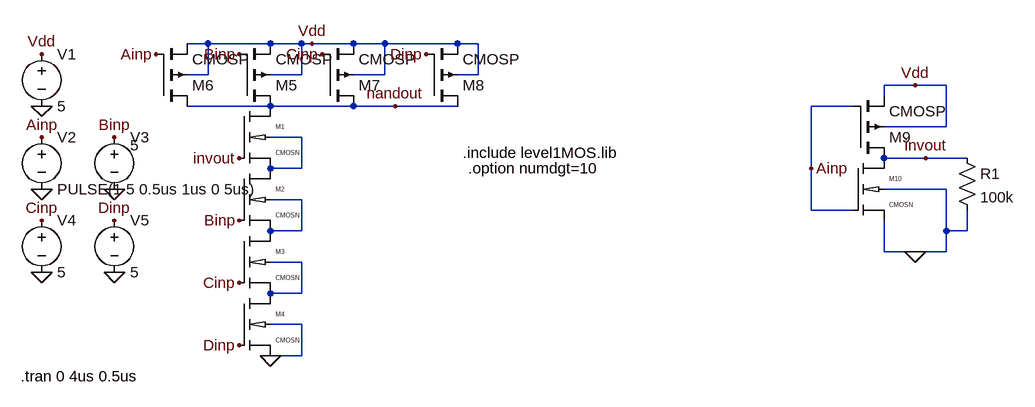
[diagram p0: schematic inv_4inpNAND.asc]
inv_4inpNAND.asc, the LTspice schematic file:
Version 4
SHEET 1 1312 680
WIRE 96 16 64 16
WIRE 192 16 96 16
WIRE 240 16 192 16
WIRE 256 16 240 16
WIRE 320 16 256 16
WIRE 368 16 320 16
WIRE 480 16 368 16
WIRE 512 16 480 16
WIRE 96 64 96 16
WIRE 96 64 64 64
WIRE 240 64 240 16
WIRE 240 64 192 64
WIRE 368 64 368 16
WIRE 368 64 320 64
WIRE 512 64 512 16
WIRE 512 64 480 64
WIRE 1184 80 1136 80
WIRE 1232 80 1184 80
WIRE 1136 96 1136 80
WIRE 192 112 64 112
WIRE 320 112 192 112
WIRE 384 112 320 112
WIRE 480 112 384 112
WIRE 1088 112 1024 112
WIRE 1232 144 1232 80
WIRE 1232 144 1136 144
WIRE 240 160 192 160
WIRE 1200 192 1136 192
WIRE 1264 192 1200 192
WIRE 240 208 240 160
WIRE 240 208 192 208
WIRE 1024 208 1024 112
WIRE 1232 240 1136 240
WIRE 240 256 192 256
WIRE 1024 272 1024 208
WIRE 1088 272 1024 272
WIRE 240 304 240 256
WIRE 240 304 192 304
WIRE 1232 304 1232 240
WIRE 1264 304 1264 272
WIRE 1264 304 1232 304
WIRE 1136 336 1136 288
WIRE 1184 336 1136 336
WIRE 1232 336 1232 304
WIRE 1232 336 1184 336
WIRE 240 352 192 352
WIRE 240 400 240 352
WIRE 240 400 192 400
WIRE 240 448 192 448
WIRE 240 496 240 448
WIRE 240 496 192 496
FLAG 16 32 Ainp
FLAG 144 288 Binp
FLAG 144 32 Binp
FLAG 144 384 Cinp
FLAG 272 32 Cinp
FLAG 144 480 Dinp
FLAG 432 32 Dinp
FLAG 192 496 0
FLAG -160 240 0
FLAG -160 112 0
FLAG -160 160 Ainp
FLAG -160 32 Vdd
FLAG 256 16 Vdd
FLAG -48 240 0
FLAG -160 368 0
FLAG -48 368 0
FLAG -48 160 Binp
FLAG -160 288 Cinp
FLAG -48 288 Dinp
FLAG 1184 336 0
FLAG 1184 80 Vdd
FLAG 384 112 nandout
FLAG 1200 192 invout
FLAG 144 192 invout
FLAG 1024 208 Ainp
SYMBOL cmosn 144 112 R0
SYMATTR InstName M1
SYMATTR Value2 l=0.36u w=0.72u
SYMBOL cmosn 144 208 R0
SYMATTR InstName M2
SYMATTR Value2 l=0.36u w=0.72u
SYMBOL cmosn 144 304 R0
SYMATTR InstName M3
SYMATTR Value2 l=0.36u w=0.72u
SYMBOL cmosn 144 400 R0
SYMATTR InstName M4
SYMATTR Value2 l=0.36u w=0.72u
SYMBOL cmosp 144 112 M180
SYMATTR InstName M5
SYMATTR Value2 l=0.36u w=2.88u
SYMBOL cmosp 16 112 M180
SYMATTR InstName M6
SYMATTR Value2 l=0.36u w=2.88u
SYMBOL cmosp 272 112 M180
SYMATTR InstName M7
SYMATTR Value2 l=0.36u w=2.88u
SYMBOL cmosp 432 112 M180
SYMATTR InstName M8
SYMATTR Value2 l=0.36u w=2.88u
SYMBOL voltage -160 16 R0
WINDOW 123 0 0 Left 2
WINDOW 39 0 0 Left 2
SYMATTR InstName V1
SYMATTR Value 5
SYMBOL voltage -160 144 R0
WINDOW 123 0 0 Left 2
WINDOW 39 0 0 Left 2
SYMATTR InstName V2
SYMATTR Value PULSE(1 5 0.5us 1us 0 5us)
SYMBOL voltage -48 144 R0
WINDOW 123 0 0 Left 2
WINDOW 39 0 0 Left 2
WINDOW 3 24 28 Left 2
SYMATTR InstName V3
SYMATTR Value 5
SYMBOL voltage -160 272 R0
WINDOW 123 0 0 Left 2
WINDOW 39 0 0 Left 2
SYMATTR InstName V4
SYMATTR Value 5
SYMBOL voltage -48 272 R0
WINDOW 123 0 0 Left 2
WINDOW 39 0 0 Left 2
SYMATTR InstName V5
SYMATTR Value 5
SYMBOL cmosp 1088 192 M180
SYMATTR InstName M9
SYMATTR Value2 l=0.36u w=1.44u
SYMBOL cmosn 1088 192 R0
SYMATTR InstName M10
SYMATTR Value2 l=0.36u w=0.72u
SYMBOL res 1248 176 R0
SYMATTR InstName R1
SYMATTR Value 100k
TEXT -192 528 Left 2 !.tran 0 4us 0.5us
TEXT 488 184 Left 2 !.include level1MOS.lib
TEXT 496 208 Left 2 !.option numdgt=10

The netlist it stands for:
* inv_4inpNAND.asc
M1 nandout invout N001 N001 CMOSN l=0.36u w=0.72u
M2 N001 Binp N002 N002 CMOSN l=0.36u w=0.72u
M3 N002 Cinp N003 N003 CMOSN l=0.36u w=0.72u
M4 N003 Dinp 0 0 CMOSN l=0.36u w=0.72u
M5 nandout Binp Vdd Vdd CMOSP l=0.36u w=2.88u
M6 nandout Ainp Vdd Vdd CMOSP l=0.36u w=2.88u
M7 nandout Cinp Vdd Vdd CMOSP l=0.36u w=2.88u
M8 nandout Dinp Vdd Vdd CMOSP l=0.36u w=2.88u
V1 Vdd 0 5
V2 Ainp 0 PULSE(1 5 0.5us 1us 0 5us)
V3 Binp 0 5
V4 Cinp 0 5
V5 Dinp 0 5
M9 invout Ainp Vdd Vdd CMOSP l=0.36u w=1.44u
M10 invout Ainp 0 0 CMOSN l=0.36u w=0.72u
R1 invout 0 100k
.model NMOS NMOS
.model PMOS PMOS
.lib standard.mos
.tran 0 4us 0.5us
.include level1MOS.lib
.option numdgt=10
.lib tsmc018.lib
.backanno
.end

* Results of the author's LTspice run, read from the files saved beside the schematic
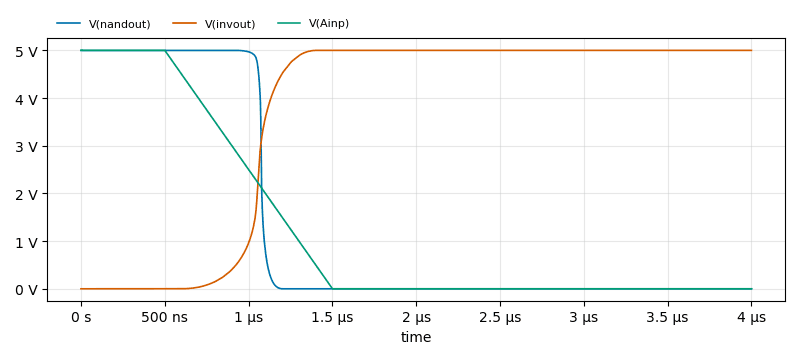
[diagram p1: Transient Analysis of inv_4inpNAND.asc, plotted from the saved traces]
* Transient Analysis, 1 run:
*   V(nandout): min -28.15 µV, max 5 V, average 1.351 V, rms 2.585 V, last 0 V
*   V(invout): min -5.542 µV, max 5 V, average 3.674 V, rms 4.242 V, last 5 V
*   V(Ainp): min 0 V, max 5 V, average 1.25 V, rms 2.282 V, last 0 V